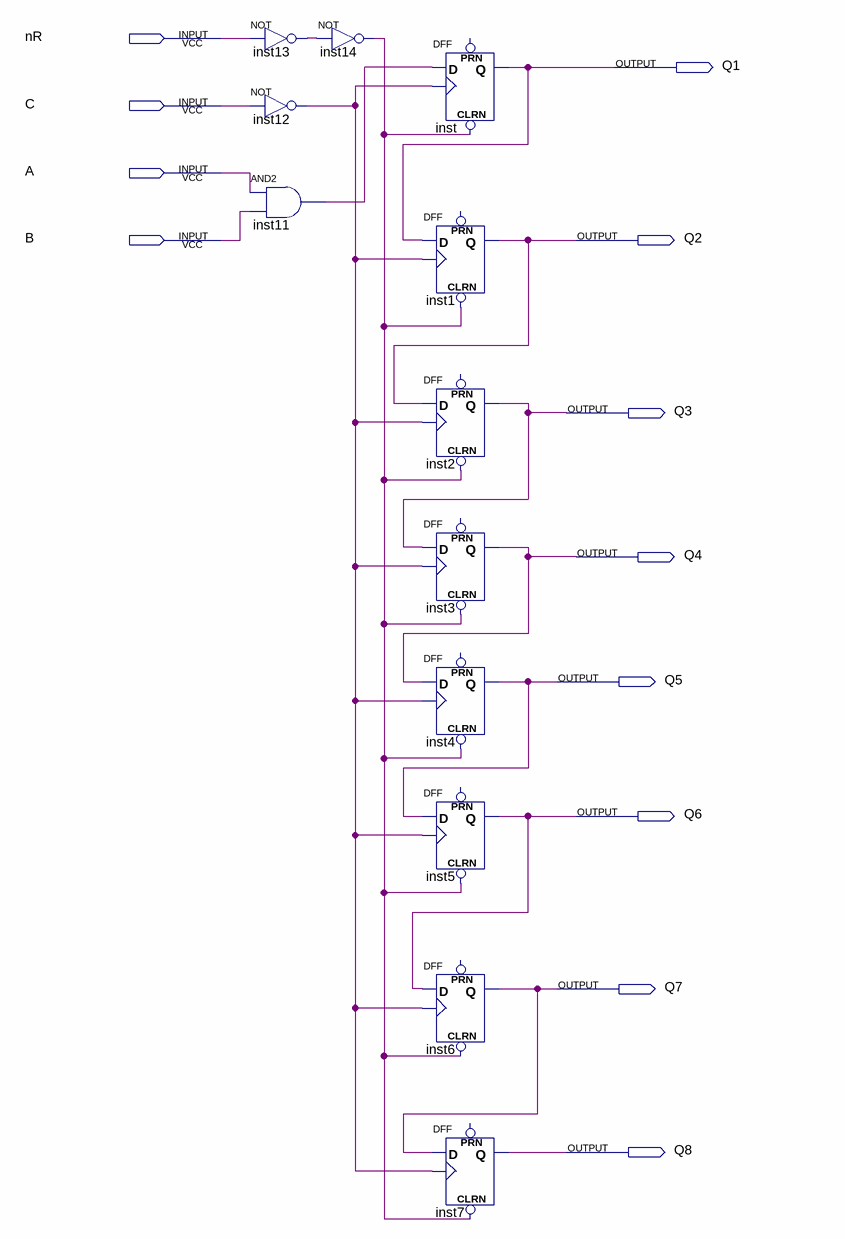
[diagram p0: schematic sheet]
// Quartus schematic KP1533IR8.bdf as structural Verilog: 12 symbols, 12 pins
module KP1533IR8 (
  input  nR,
  input  C,
  input  A,
  input  B,
  output Q1,
  output Q2,
  output Q3,
  output Q4,
  output Q5,
  output Q6,
  output Q7,
  output Q8
);

  wire inst11_out, inst12_out, inst13_out, inst14_out;

  not inst13 (inst13_out, nR);
  not inst12 (inst12_out, C);
  and inst11 (inst11_out, A, B);
  not inst14 (inst14_out, inst13_out);
  DFF inst (.CLRN(inst14_out), .CLK(inst12_out), .D(inst11_out), .Q(Q1));  // open: PRN
  DFF inst1 (.CLRN(inst14_out), .CLK(inst12_out), .D(Q1), .Q(Q2));  // open: PRN
  DFF inst2 (.CLRN(inst14_out), .CLK(inst12_out), .D(Q2), .Q(Q3));  // open: PRN
  DFF inst3 (.CLRN(inst14_out), .CLK(inst12_out), .D(Q3), .Q(Q4));  // open: PRN
  DFF inst4 (.CLRN(inst14_out), .CLK(inst12_out), .D(Q4), .Q(Q5));  // open: PRN
  DFF inst5 (.CLRN(inst14_out), .CLK(inst12_out), .D(Q5), .Q(Q6));  // open: PRN
  DFF inst6 (.CLRN(inst14_out), .CLK(inst12_out), .D(Q6), .Q(Q7));  // open: PRN
  DFF inst7 (.CLRN(inst14_out), .CLK(inst12_out), .D(Q7), .Q(Q8));  // open: PRN
endmodule
